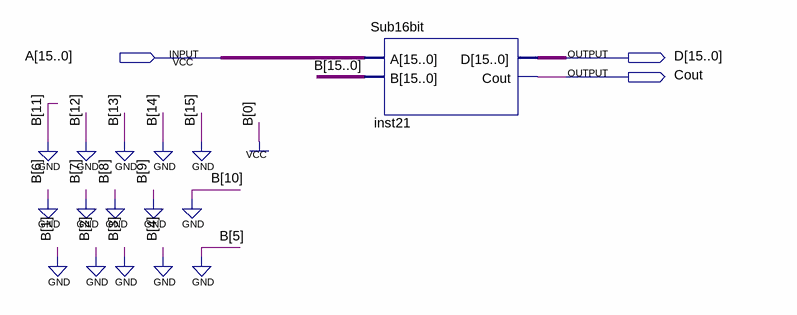
[diagram p0: schematic sheet]
// Quartus schematic Sub1_16bit.bdf as structural Verilog: 1 symbols, 3 pins
module Sub1_16bit (
  input  [15:0] A,
  output [15:0] D,
  output Cout
);

  Sub16bit inst21 (.A(A), .B(16'b0000000000000001), .D(D), .Cout(Cout));
endmodule
